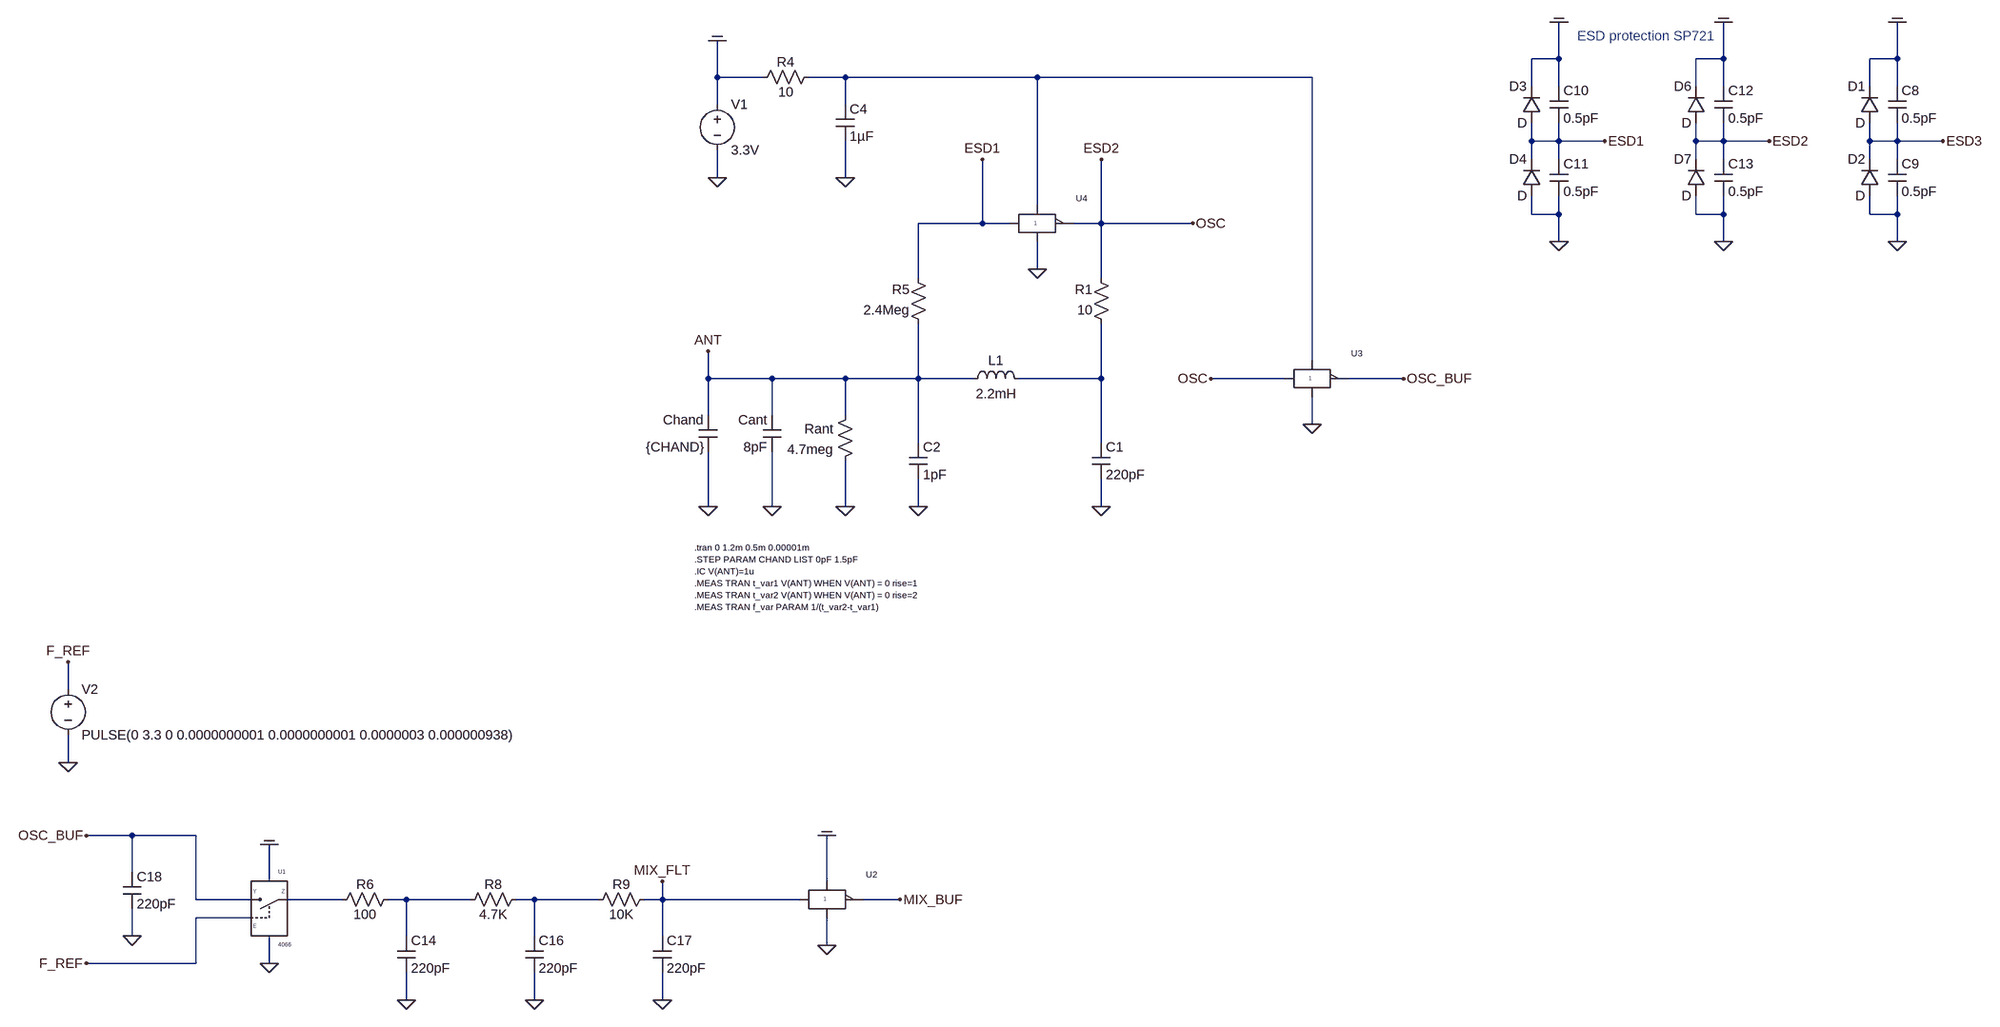
[diagram p0: schematic 2020_analog_oscill_sin_33v_v07_heter.asc]
2020_analog_oscill_sin_33v_v07_heter.asc, the LTspice schematic file:
Version 4
SHEET 1 2908 1572
WIRE 432 -368 432 -432
WIRE 432 -368 384 -368
WIRE 720 -368 720 -432
WIRE 720 -368 672 -368
WIRE 1024 -368 1024 -432
WIRE 1024 -368 976 -368
WIRE -1056 -336 -1056 -400
WIRE -976 -336 -1056 -336
WIRE -832 -336 -896 -336
WIRE -496 -336 -832 -336
WIRE 0 -336 -496 -336
WIRE 384 -320 384 -368
WIRE 432 -320 432 -368
WIRE 672 -320 672 -368
WIRE 720 -320 720 -368
WIRE 976 -320 976 -368
WIRE 1024 -320 1024 -368
WIRE -1056 -288 -1056 -336
WIRE -832 -288 -832 -336
WIRE 384 -224 384 -256
WIRE 432 -224 432 -256
WIRE 432 -224 384 -224
WIRE 512 -224 432 -224
WIRE 672 -224 672 -256
WIRE 720 -224 720 -256
WIRE 720 -224 672 -224
WIRE 800 -224 720 -224
WIRE 976 -224 976 -256
WIRE 1024 -224 1024 -256
WIRE 1024 -224 976 -224
WIRE 1104 -224 1024 -224
WIRE 384 -192 384 -224
WIRE 432 -192 432 -224
WIRE 672 -192 672 -224
WIRE 720 -192 720 -224
WIRE 976 -192 976 -224
WIRE 1024 -192 1024 -224
WIRE -1056 -160 -1056 -208
WIRE -832 -160 -832 -224
WIRE -496 -112 -496 -336
WIRE 384 -96 384 -128
WIRE 432 -96 432 -128
WIRE 432 -96 384 -96
WIRE 672 -96 672 -128
WIRE 720 -96 720 -128
WIRE 720 -96 672 -96
WIRE 976 -96 976 -128
WIRE 1024 -96 1024 -128
WIRE 1024 -96 976 -96
WIRE -592 -80 -592 -192
WIRE -592 -80 -704 -80
WIRE -544 -80 -592 -80
WIRE -384 -80 -384 -192
WIRE -384 -80 -432 -80
WIRE -224 -80 -384 -80
WIRE 432 -48 432 -96
WIRE 720 -48 720 -96
WIRE 1024 -48 1024 -96
WIRE -496 0 -496 -48
WIRE -704 16 -704 -80
WIRE -384 16 -384 -80
WIRE 0 160 0 -336
WIRE -1072 192 -1072 144
WIRE -960 192 -1072 192
WIRE -832 192 -960 192
WIRE -704 192 -704 96
WIRE -704 192 -832 192
WIRE -608 192 -704 192
WIRE -384 192 -384 96
WIRE -384 192 -528 192
WIRE -48 192 -192 192
WIRE 160 192 64 192
WIRE -1072 256 -1072 192
WIRE -960 256 -960 192
WIRE -832 256 -832 192
WIRE 0 272 0 224
WIRE -704 304 -704 192
WIRE -384 304 -384 192
WIRE -1072 416 -1072 320
WIRE -960 416 -960 320
WIRE -832 416 -832 336
WIRE -704 416 -704 368
WIRE -384 416 -384 368
WIRE -2192 736 -2192 688
WIRE -2192 864 -2192 816
WIRE -2080 992 -2160 992
WIRE -1968 992 -2080 992
WIRE -2080 1056 -2080 992
WIRE -1840 1072 -1840 1008
WIRE -864 1072 -864 992
WIRE -1968 1104 -1968 992
WIRE -1872 1104 -1968 1104
WIRE -1712 1104 -1808 1104
WIRE -1600 1104 -1632 1104
WIRE -1488 1104 -1600 1104
WIRE -1376 1104 -1408 1104
WIRE -1264 1104 -1376 1104
WIRE -1152 1104 -1152 1072
WIRE -1152 1104 -1184 1104
WIRE -912 1104 -1152 1104
WIRE -736 1104 -800 1104
WIRE -1872 1136 -1968 1136
WIRE -2080 1168 -2080 1120
WIRE -1600 1168 -1600 1104
WIRE -1376 1168 -1376 1104
WIRE -1152 1168 -1152 1104
WIRE -864 1184 -864 1136
WIRE -1968 1216 -1968 1136
WIRE -1968 1216 -2160 1216
WIRE -1840 1216 -1840 1168
WIRE -1600 1280 -1600 1232
WIRE -1376 1280 -1376 1232
WIRE -1152 1280 -1152 1232
FLAG -1056 -160 0
FLAG -1072 416 0
FLAG -1072 144 ANT
FLAG -832 416 0
FLAG -1056 -400 COM
FLAG 432 -48 0
FLAG 432 -432 COM
FLAG 512 -224 ESD1
FLAG 720 -48 0
FLAG 720 -432 COM
FLAG 800 -224 ESD2
FLAG 1024 -48 0
FLAG 1024 -432 COM
FLAG 1104 -224 ESD3
FLAG -960 416 0
FLAG -592 -192 ESD1
FLAG 160 192 OSC_BUF
FLAG -832 -160 0
FLAG -224 -80 OSC
FLAG -384 -192 ESD2
FLAG -2160 992 OSC_BUF
FLAG -2160 1216 F_REF
FLAG -1840 1008 COM
FLAG -1840 1216 0
FLAG -1600 1280 0
FLAG -1376 1280 0
FLAG -1152 1280 0
FLAG -1152 1072 MIX_FLT
FLAG -2192 864 0
FLAG -2192 688 F_REF
FLAG -2080 1168 0
FLAG -864 992 COM
FLAG -864 1184 0
FLAG -736 1104 MIX_BUF
FLAG 0 272 0
FLAG -192 192 OSC
FLAG -496 0 0
FLAG -384 416 0
FLAG -704 416 0
SYMBOL voltage -1056 -304 R0
WINDOW 123 0 0 Left 2
WINDOW 39 0 0 Left 2
SYMATTR InstName V1
SYMATTR Value 3.3V
SYMBOL ind -512 208 M270
WINDOW 0 32 56 VTop 2
WINDOW 3 5 56 VBottom 2
SYMATTR InstName L1
SYMATTR Value 2.2mH
SYMATTR SpiceLine Ipk=0.1 Rser=69 Rpar=1.536Meg Cpar=1.147pF
SYMBOL cap -1056 256 M0
SYMATTR InstName Chand
SYMATTR Value {CHAND}
SYMBOL res -816 240 M0
SYMATTR InstName Rant
SYMATTR Value 4.7meg
SYMBOL diode 400 -256 R180
WINDOW 0 24 64 Left 2
WINDOW 3 24 0 Left 2
SYMATTR InstName D3
SYMBOL diode 400 -128 R180
WINDOW 0 24 64 Left 2
WINDOW 3 24 0 Left 2
SYMATTR InstName D4
SYMBOL cap 416 -320 R0
SYMATTR InstName C10
SYMATTR Value 0.5pF
SYMBOL cap 416 -192 R0
SYMATTR InstName C11
SYMATTR Value 0.5pF
SYMBOL diode 688 -256 R180
WINDOW 0 24 64 Left 2
WINDOW 3 24 0 Left 2
SYMATTR InstName D6
SYMBOL diode 688 -128 R180
WINDOW 0 24 64 Left 2
WINDOW 3 24 0 Left 2
SYMATTR InstName D7
SYMBOL cap 704 -320 R0
SYMATTR InstName C12
SYMATTR Value 0.5pF
SYMBOL cap 704 -192 R0
SYMATTR InstName C13
SYMATTR Value 0.5pF
SYMBOL diode 992 -256 R180
WINDOW 0 24 64 Left 2
WINDOW 3 24 0 Left 2
SYMATTR InstName D1
SYMBOL diode 992 -128 R180
WINDOW 0 24 64 Left 2
WINDOW 3 24 0 Left 2
SYMATTR InstName D2
SYMBOL cap 1008 -320 R0
SYMATTR InstName C8
SYMATTR Value 0.5pF
SYMBOL cap 1008 -192 R0
SYMATTR InstName C9
SYMATTR Value 0.5pF
SYMBOL cap -944 256 M0
SYMATTR InstName Cant
SYMATTR Value 8pF
SYMBOL res -880 -352 R90
WINDOW 0 5 56 VBottom 2
WINDOW 3 27 56 VTop 2
SYMATTR InstName R4
SYMATTR Value 10
SYMBOL cap -848 -288 R0
SYMATTR InstName C4
SYMATTR Value 1µF
SYMBOL Dig_Add\\CD4xxx\\cd4066 -1840 1120 R0
SYMATTR InstName U1
SYMBOL cap -1616 1168 R0
SYMATTR InstName C14
SYMATTR Value 220pF
SYMBOL res -1616 1088 R90
WINDOW 0 5 56 VBottom 2
WINDOW 3 27 56 VTop 2
SYMATTR InstName R6
SYMATTR Value 100
SYMBOL cap -1392 1168 R0
SYMATTR InstName C16
SYMATTR Value 220pF
SYMBOL res -1392 1088 R90
WINDOW 0 5 56 VBottom 2
WINDOW 3 27 56 VTop 2
SYMATTR InstName R8
SYMATTR Value 4.7K
SYMBOL cap -1168 1168 R0
SYMATTR InstName C17
SYMATTR Value 220pF
SYMBOL res -1168 1088 R90
WINDOW 0 5 56 VBottom 2
WINDOW 3 27 56 VTop 2
SYMATTR InstName R9
SYMATTR Value 10K
SYMBOL voltage -2192 720 R0
WINDOW 123 0 0 Left 2
WINDOW 39 0 0 Left 2
SYMATTR InstName V2
SYMATTR Value PULSE(0 3.3 0 0.0000000001 0.0000000001 0.0000003 0.000000938)
SYMBOL cap -2096 1056 R0
SYMATTR InstName C18
SYMATTR Value 220pF
SYMBOL SBORKA\\Logika\\74AHC1G04 -864 1056 R0
SYMATTR InstName U2
SYMBOL SBORKA\\Logika\\74AHC1G04 0 144 R0
SYMATTR InstName U3
SYMBOL SBORKA\\Logika\\74AHC1G04 -496 -128 R0
SYMATTR InstName U4
SYMBOL cap -400 304 R0
SYMATTR InstName C1
SYMATTR Value 220pF
SYMBOL res -688 112 R180
WINDOW 0 31 76 Left 2
WINDOW 3 31 40 Left 2
SYMATTR InstName R5
SYMATTR Value 2.4Meg
SYMBOL res -368 112 R180
WINDOW 0 31 76 Left 2
WINDOW 3 31 40 Left 2
SYMATTR InstName R1
SYMATTR Value 10
SYMBOL cap -720 304 R0
SYMATTR InstName C2
SYMATTR Value 1pF
TEXT -1096 488 Left 1 !.tran 0 1.2m 0.5m 0.00001m\n.STEP PARAM CHAND LIST 0pF 1.5pF\n.IC V(ANT)=1u\n.MEAS TRAN t_var1 V(ANT) WHEN V(ANT) = 0 rise=1\n.MEAS TRAN t_var2 V(ANT) WHEN V(ANT) = 0 rise=2\n.MEAS TRAN f_var PARAM 1/(t_var2-t_var1)
TEXT 464 -408 Left 2 ;ESD protection SP721

The netlist it stands for:
* 2020_analog_oscill_sin_33v_v07_heter.asc
V1 COM 0 3.3V
L1 N002 ANT 2.2mH Ipk=0.1 Rser=69 Rpar=1.536Meg Cpar=1.147pF
Chand ANT 0 {CHAND}
Rant ANT 0 4.7meg
D3 ESD1 COM D
D4 0 ESD1 D
C10 COM ESD1 0.5pF
C11 ESD1 0 0.5pF
D6 OSC COM D
D7 0 OSC D
C12 COM OSC 0.5pF
C13 OSC 0 0.5pF
D1 ESD3 COM D
D2 0 ESD3 D
C8 COM ESD3 0.5pF
C9 ESD3 0 0.5pF
Cant ANT 0 8pF
R4 N001 COM 10
C4 N001 0 1µF
XU1 OSC_BUF N003 F_REF COM 0 4066  ; pins Y OUT EN VCC VSS
C14 N004 0 220pF
R6 N004 N003 100
C16 N005 0 220pF
R8 N005 N004 4.7K
C17 MIX_FLT 0 220pF
R9 MIX_FLT N005 10K
V2 F_REF 0 PULSE(0 3.3 0 0.0000000001 0.0000000001 0.0000003 0.000000938)
C18 OSC_BUF 0 220pF
XU2 MIX_FLT MIX_BUF COM 0 74AHC1G04  ; pins in out vcc gnd
XU3 OSC OSC_BUF N001 0 74AHC1G04  ; pins in out vcc gnd
XU4 ESD1 OSC N001 0 74AHC1G04  ; pins in out vcc gnd
C1 N002 0 220pF
R5 ANT ESD1 2.4Meg
R1 N002 OSC 10
C2 ANT 0 1pF
.model D D
.lib standard.dio
.tran 0 1.2m 0.5m 0.00001m
.STEP PARAM CHAND LIST 0pF 1.5pF
.IC V(ANT)=1u
.MEAS TRAN t_var1 V(ANT) WHEN V(ANT) = 0 rise=1
.MEAS TRAN t_var2 V(ANT) WHEN V(ANT) = 0 rise=2
.MEAS TRAN f_var PARAM 1/(t_var2-t_var1)
* ESD protection SP721
.lib SwitchAna.lib
.lib 74AHC1G04.cir
.backanno
.end